# EAGLE design robocon line following sensor compact (EAGLE 7.2.0)
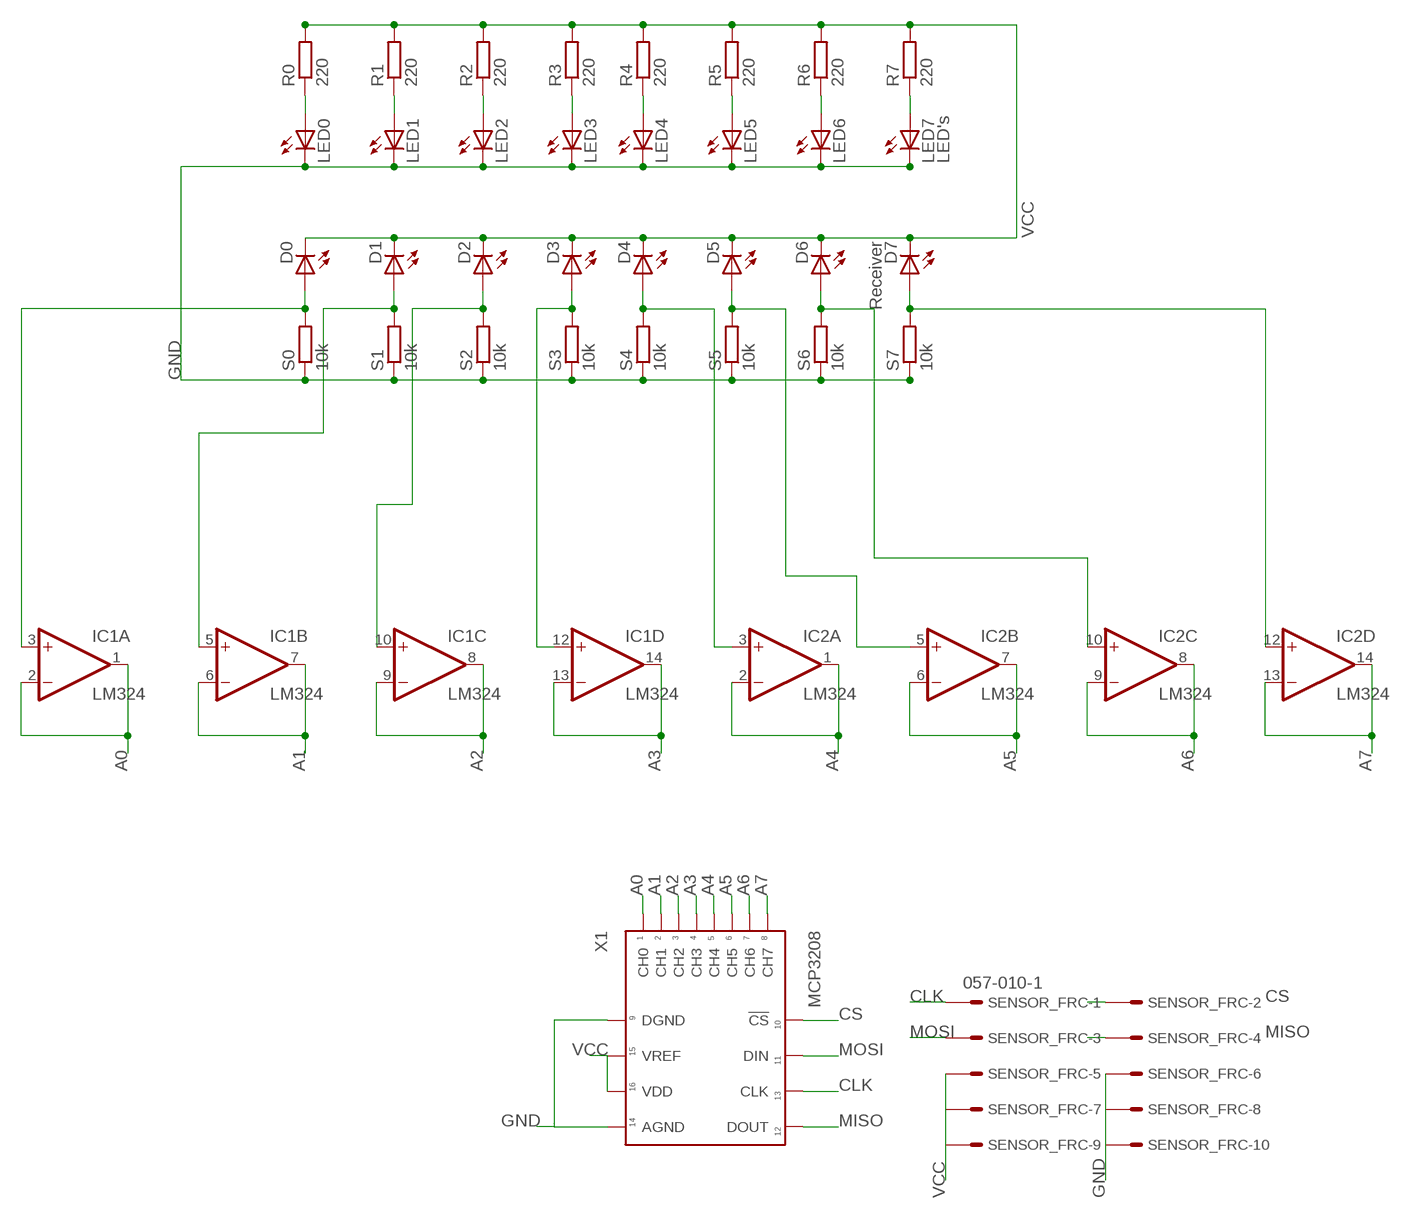
[diagram p0: schematic, sheet 1]

## Parts
D0  LED5MM  [LED5MM]
D1  LED5MM  [LED5MM]
D2  LED5MM  [LED5MM]
D3  LED5MM  [LED5MM]
D4  LED5MM  [LED5MM]
D5  LED5MM  [LED5MM]
D6  LED5MM  [LED5MM]
D7  Receiver  LED5MM  [LED5MM]
IC1  LM324  LM324N  [DIL14]
IC2  LM324  LM324N  [DIL14]
LED0  LED5MM  [LED5MM]
LED1  LED5MM  [LED5MM]
LED2  LED5MM  [LED5MM]
LED3  LED5MM  [LED5MM]
LED4  LED5MM  [LED5MM]
LED5  LED5MM  [LED5MM]
LED6  LED5MM  [LED5MM]
LED7  LED's  LED5MM  [LED5MM]
R0  220  R-EU_0207/10  [0207/10]
R1  220  R-EU_0207/10  [0207/10]
R2  220  R-EU_0207/10  [0207/10]
R3  220  R-EU_0207/10  [0207/10]
R4  220  R-EU_0207/10  [0207/10]
R5  220  R-EU_0207/10  [0207/10]
R6  220  R-EU_0207/10  [0207/10]
R7  220  R-EU_0207/10  [0207/10]
S0  10k  R-EU_0207/10  [0207/10]
S1  10k  R-EU_0207/10  [0207/10]
S2  10k  R-EU_0207/10  [0207/10]
S3  10k  R-EU_0207/10  [0207/10]
S4  10k  R-EU_0207/10  [0207/10]
S5  10k  R-EU_0207/10  [0207/10]
S6  10k  R-EU_0207/10  [0207/10]
S7  10k  R-EU_0207/10  [0207/10]
SENSOR_FRC  057-010-1  [057-010-1]
X1  MCP3208  21298EDIP  [DIP16]

## Nets
A0: IC1.1(A:OUT) IC1.2(A:-IN) X1.P$1(CH0)
A1: IC1.6(B:-IN) IC1.7(B:OUT) X1.P$2(CH1)
A2: IC1.8(C:OUT) IC1.9(C:-IN) X1.P$3(CH2)
A3: IC1.13(D:-IN) IC1.14(D:OUT) X1.P$4(CH3)
A4: IC2.1(A:OUT) IC2.2(A:-IN) X1.P$5(CH4)
A5: IC2.6(B:-IN) IC2.7(B:OUT) X1.P$6(CH5)
A6: IC2.8(C:OUT) IC2.9(C:-IN) X1.P$7(CH6)
A7: IC2.13(D:-IN) IC2.14(D:OUT) X1.P$8(CH7)
CLK: SENSOR_FRC.1 X1.P$13(CLK)
CS: SENSOR_FRC.2 X1.P$10(!CS)
GND: LED0.K(C) LED1.K(C) LED2.K(C) LED3.K(C) LED4.K(C) LED5.K(C) LED6.K(C) LED7.K(C) S0.1 S1.1 S2.1 S3.1 S4.1 S5.1 S6.1 S7.1 SENSOR_FRC.6 SENSOR_FRC.8 SENSOR_FRC.10 X1.P$9(DGND) X1.P$14(AGND)
MISO: SENSOR_FRC.4 X1.P$12(DOUT)
MOSI: SENSOR_FRC.3 X1.P$11(DIN)
N$1: LED0.A R0.1
N$2: LED1.A R1.1
N$3: LED2.A R2.1
N$4: LED3.A R3.1
N$5: LED4.A R4.1
N$6: LED5.A R5.1
N$7: LED6.A R6.1
N$8: LED7.A R7.1
N$11: D1.A IC1.5(B:+IN) S1.2
N$12: D2.A IC1.10(C:+IN) S2.2
N$13: D3.A IC1.12(D:+IN) S3.2
N$14: D4.A IC2.3(A:+IN) S4.2
N$15: D5.A IC2.5(B:+IN) S5.2
N$16: D6.A IC2.10(C:+IN) S6.2
N$18: D7.A IC2.12(D:+IN) S7.2
N$29: D0.A IC1.3(A:+IN) S0.2
VCC: D0.K(C) D1.K(C) D2.K(C) D3.K(C) D4.K(C) D5.K(C) D6.K(C) D7.K(C) R0.2 R1.2 R2.2 R3.2 R4.2 R5.2 R6.2 R7.2 SENSOR_FRC.5 SENSOR_FRC.7 SENSOR_FRC.9 X1.P$15(VREF) X1.P$16(VDD)

## Power pins joined to a net without a drawn wire
GND: IC1.11(P:V-) IC2.11(P:V-)
VCC: IC1.4(P:V+) IC2.4(P:V+)

## Library data of the parts
D0 D1-D7 LED0 LED1-LED7 = led:LED: LED OSRAM: - CHIPLED LG R971, LG N971, LY N971, LG Q971, LY Q971, LO R971, LY R971 LH N974, LH R974 LS Q976, LO Q976, LY Q976 LO Q996 - Hyper CHIPLED LW Q18S LB Q993, LB Q99A, LB R99A - SideLED LS A670, LO A670, LY A670, LG A670, LP A670 LB A673, LV A673, LT A673, LW A673 LH A674 LY A675 LS A676, LA A676, LO A676, LY A676, LW A676 LS A679, LY A679, LG A679 - Hyper Micro SIDELED® LS Y876, LA Y876, LO Y876, LY Y876 LT Y87S - SmartLED LW L88C, LW L88S LB L89C, LB L89S, LG L890 LS L89K, LO L89K, LY L89K LS L896, LA L896, LO L896, LY L896 - TOPLED LS T670, LO T670, LY T670, LG T670, LP T670 LSG T670, LSP T670, LSY T670, LOP T670, LYG T670 LG T671, LOG T671, LSG T671 LB T673, LV T673, LT T673, LW T673 LH T674 LS T676, LA T676, LO T676, LY T676, LB T676, LH T676, LSB T676, LW T676 LB T67C, LV T67C, LT T67C, LS T67K, LO T67K, LY T67K, LW E67C LS E67B, LA E67B, LO E67B, LY E67B, LB E67C, LV E67C, LT E67C LW T67C LS T679, LY T679, LG T679 LS T770, LO T770, LY T770, LG T770, LP T770 LB T773, LV T773, LT T773, LW T773 LH T774 LS E675, LA E675, LY E675, LS T675 LS T776, LA T776, LO T776, LY T776, LB T776 LHGB T686 LT T68C, LB T68C - Hyper Mini TOPLED® LB M676 - Mini TOPLED Santana® LG M470 LS M47K, LO M47K, LY M47K Source: http://www.osram.convergy.de LUXEON: - LUMILED® LXK2-PW12-R00, LXK2-PW12-S00, LXK2-PW14-U00, LXK2-PW14-V00 LXK2-PM12-R00, LXK2-PM12-S00, LXK2-PM14-U00 LXK2-PE12-Q00, LXK2-PE12-R00, LXK2-PE12-S00, LXK2-PE14-T00, LXK2-PE14-U00 LXK2-PB12-K00, LXK2-PB12-L00, LXK2-PB12-M00, LXK2-PB14-N00, LXK2-PB14-P00, LXK2-PB14-Q00 LXK2-PR12-L00, LXK2-PR12-M00, LXK2-PR14-Q00, LXK2-PR14-R00 LXK2-PD12-Q00, LXK2-PD12-R00, LXK2-PD12-S00 LXK2-PH12-R00, LXK2-PH12-S00 LXK2-PL12-P00, LXK2-PL12-Q00, LXK2-PL12-R00 Source: www.luxeon.com KINGBRIGHT: KA-3528ASYC Source: www.kingbright.com
IC1 IC2 = linear:LM324: OP AMP
R0 R1-R7 S0 S1-S7 = rcl:R-EU_: RESISTOR, European symbol
SENSOR_FRC = con-panduit:057-010-: CONNECTOR 10-pin series 057 contact pc board low profile headers; OC_FARNELL: unknown; OC_NEWARK: unknown
X1 = Microchip:21298E

## Board
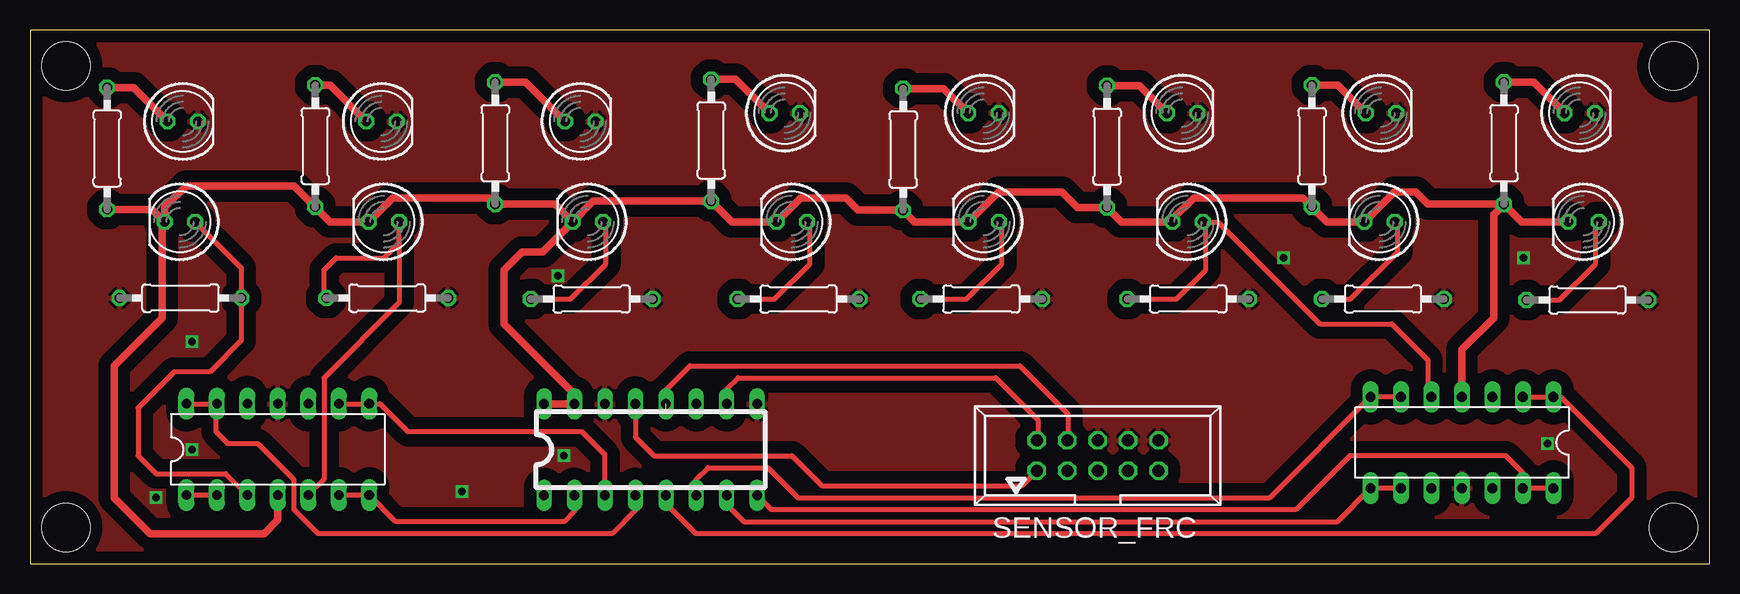
[diagram p1: board, top side]
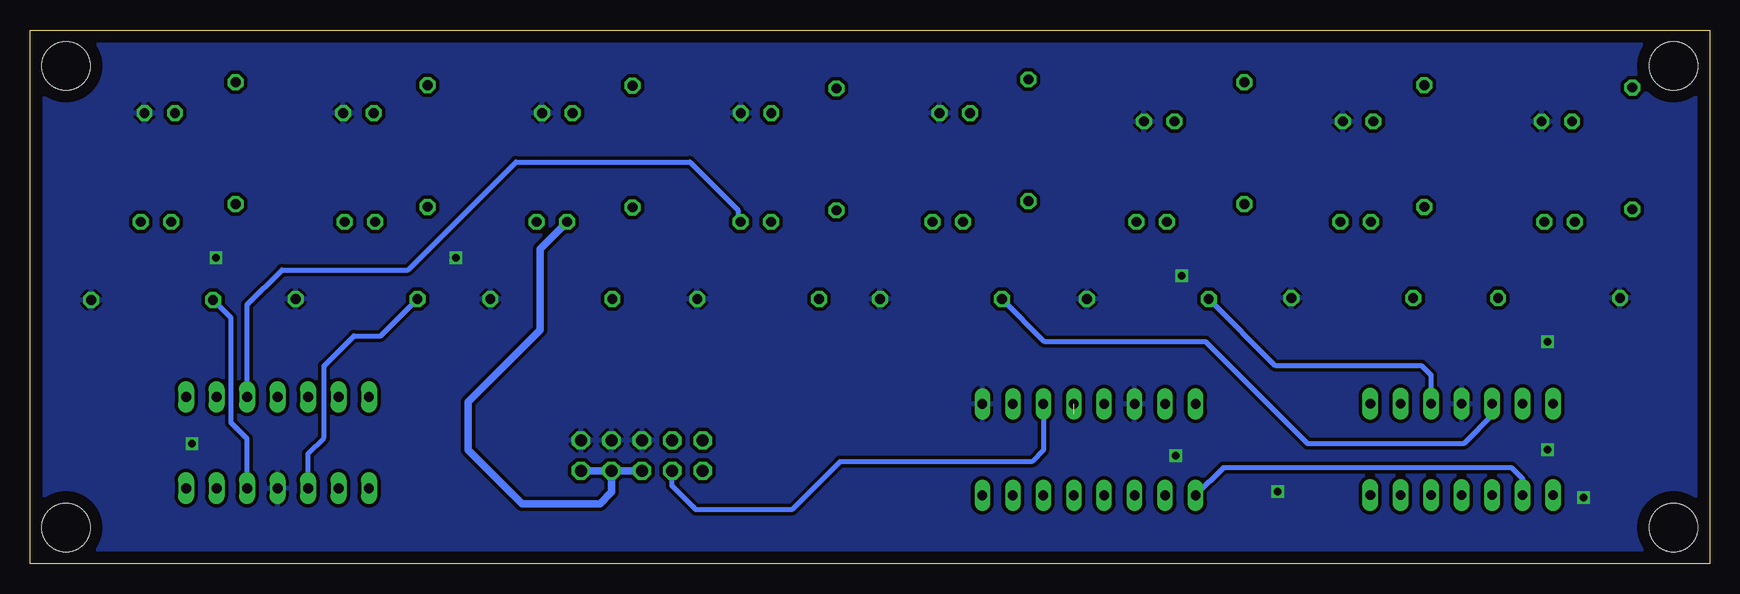
[diagram p2: board, bottom side, seen from below]

Size 140 x 44.5 mm. Coordinates in mm from the lower left corner, seen from the top.
Outline: 0,0 140,0 140,44.5 0,44.5 0,0
Copper layers (1*16): Top 0.035mm / dielectric 1.5mm / Bottom 0.035mm
Design rules "default *": minimum track width 10mil, minimum drill 24mil, track to track 10mil, track to pad 10mil, pad to pad 10mil, via to via 10mil, smd to smd 8mil, copper to edge 40mil, drill to drill 8mil, minimum pad ring 10mil, minimum via ring 8mil, stop-mask expansion 4mil, vias tented up to drill 0mil, thermal gap 10mil
Holes 4 mm at 3,41.5 137,41.5 137,3 3,3

### Footprints (pad centres in the part's own frame; a part is rotated, then mirrored left to right if it is on the bottom)
LED5MM = drill 0.813 octagon: A -1.27,0; K 1.27,0
DIL14 = drill 0.813 long: 1 -7.62,-3.81; 2 -5.08,-3.81; 3 -2.54,-3.81; 4 0,-3.81; 5 2.54,-3.81; 6 5.08,-3.81; 7 7.62,-3.81; 8 7.62,3.81; 9 5.08,3.81; 10 2.54,3.81; 11 0,3.81; 12 -2.54,3.81; 13 -5.08,3.81; 14 -7.62,3.81
0207/10 = drill 0.813 octagon: 1 -5.08,0; 2 5.08,0
057-010-1 = drill 1 octagon: 1 -5.08,-1.27; 2 -5.08,1.27; 3 -2.54,-1.27; 4 -2.54,1.27; 5 0,-1.27; 6 0,1.27; 7 2.54,-1.27; 8 2.54,1.27; 9 5.08,-1.27; 10 5.08,1.27
DIP16 = drill 0.8 long: P$1 -10.16,-3.81; P$2 -7.62,-3.81; P$3 -5.08,-3.81; P$4 -2.54,-3.81; P$5 0,-3.81; P$6 2.54,-3.81; P$7 5.08,-3.81; P$8 7.62,-3.81; P$9 7.62,3.81; P$10 5.08,3.81; P$11 2.54,3.81; P$12 0,3.81; P$13 -2.54,3.81; P$14 -5.08,3.81; P$15 -7.62,3.81; P$16 -10.16,3.81

### Placement (x,y rotation side)
D0  12.5,28.5 180 top
D1  29.5,28.5 180 top
D2  46.5,28.5 180 top
D3  63.5,28.5 180 top
D4  79.5,28.5 180 top
D5  96.5,28.5 180 top
D6  112.5,28.5 180 top
D7  129.5,28.5 180 top
IC1  20.66,9.52 0 top
IC2  119.36,10.09 180 top
LED0  12.73,36.87 0 top
LED1  29.3,36.87 0 top
LED2  45.87,36.87 0 top
LED3  62.91,37.57 0 top
LED4  79.48,37.57 0 top
LED5  96.05,37.57 0 top
LED6  112.62,37.57 0 top
LED7  129.19,37.57 0 top
R0  6.43,34.62 270 top
R1  23.78,34.82 270 top
R2  38.78,35.06 270 top
R3  56.78,35.3 270 top
R4  72.78,34.54 270 top
R5  89.78,34.78 270 top
R6  106.86,34.82 270 top
R7  122.86,35.06 270 top
S0  12.54,22.14 0 top
S1  29.78,22.14 180 top
S2  46.82,22.06 180 top
S3  64.06,22.06 180 top
S4  79.3,22.06 180 top
S5  96.54,22.06 180 top
S6  112.78,22.06 180 top
S7  129.82,21.98 180 top
SENSOR_FRC  89,9 0 top
X1  53,9.5 0 top

### Tracks (layer width: path | path; a pad name or v marks a point on that pad's centre or on a via)
A0
  Top 0.406: IC1.1 IC1.2
  Bottom 0.406: IC1.2 15.58,7.08 16.5,8 40.53,8 X1.P$1
A1
  Top 0.406: IC1.6 IC1.7 30.49,3.5 44.5,3.5 45.38,4.38 X1.P$2
A2
  Top 0.406: IC1.9 IC1.8 29.17,13.33 31.5,11 46,11 47.92,9.08 X1.P$3
A3
  Top 0.406: IC1.14 IC1.13 15.5,13.25 15.5,11 16.5,10 19,10 22,7 22,4.5 24,2.5 48.5,2.5 50.46,4.46 X1.P$4
A4
  Top 0.406: IC2.1 IC2.2 127.6,13.9 133.5,8 133.5,5.5 130.5,2.5 55.5,2.5 53,5 X1.P$5
A5
  Top 0.406: IC2.6 IC2.7 103.34,5.5 64,5.5 61.5,8 56.5,8 55.54,7.04 X1.P$6
A6
  Top 0.406: IC2.9 IC2.8 108.96,3.5 59.5,3.5 58.08,4.92 X1.P$7
A7
  Top 0.406: IC2.14 IC2.13 124.44,7.56 123,9 110,9 105.5,4.5 61.81,4.5 X1.P$8
CLK
  Top 0.406: X1.P$13 50.46,10.54 52,9 63.5,9 66,6.5 82.69,6.5 SENSOR_FRC.1
CS
  Top 0.406: X1.P$10 58.08,14.58 59,15.5 80.5,15.5 84,12 84,10.35 SENSOR_FRC.2
GND  (via drill 0.6)
  other vias: 104.5,25.5 13.5,18.5 36,6 13.5,9.5 10.5,5.5 44,24 44.5,9 126.5,10 124.5,25.5
  pour Bottom (isolate 0.305): 0,44.5 140,44.5 140,0 0,0
  pour Top (isolate 1.016): 0,44.5 0,0 140,0 140,44.5
MISO  (1 unrouted)
  Top 0.406: 53,12.5 53,14.5 55,16.5 82.5,16.5 86.5,12.5 86.5,10.31 SENSOR_FRC.4
MOSI
  Bottom 0.406: X1.P$11 55.54,9.46 56.5,8.5 72.5,8.5 76.5,4.5 84.5,4.5 86.5,6.5 86.5,7.69 SENSOR_FRC.3
N$1
  Top 0.61: R0.1 8.63,39.7 LED0.A
N$2
  Top 0.61: R1.1 25,39.9 LED1.A
N$3
  Top 0.61: R2.1 41.33,40.14 LED2.A
N$4
  Top 0.61: R3.1 58.83,40.38 LED3.A
N$5
  Top 0.61: R4.1 76.16,39.62 LED4.A
N$6
  Top 0.61: R5.1 92.49,39.86 LED5.A
N$7
  Top 0.61: R6.1 109.02,39.9 LED6.A
N$8
  Top 0.61: R7.1 125.35,40.14 LED7.A
N$11
  Top 0.406: S1.2 24.5,22.34 24.5,24.5 25.5,25.5 29.5,25.5 30.77,26.77 | 30.77,26.77 D1.A | 30.77,26.77 30.77,21.77 24.5,15.5 24.5,7.01 IC1.5
N$12
  Top 0.406: S2.2 45.06,22.06 48,25 48,28.27 D2.A
  Bottom 0.406: IC1.10 23.2,15.7 24,16.5 36.18,16.5 S2.2
N$13
  Top 0.406: S3.2 62.06,22.06 65,25 65,28.27 D3.A
  Bottom 0.406: IC1.12 18.12,12.38 20.5,10 33.5,10 42,18.5 55.42,18.5 S3.2
N$14
  Top 0.406: S4.2 78.06,22.06 81,25 81,28.27 D4.A
  Bottom 0.406: IC2.3 121.9,21.6 119,24.5 108.5,24.5 99.5,33.5 85,33.5 81,29.5 81,28.73 D4.A
N$15
  Top 0.406: S5.2 95.56,22.06 98,24.5 98,28.27 D5.A 99,28.5 107.5,20 113.5,20 116.5,17 116.5,14.22 IC2.5
N$16
  Top 0.406: S6.2 110.06,22.06 114,26 114,28.27 D6.A
  Bottom 0.406: IC2.10 116.82,9.18 115.5,10.5 115.5,16.5 113,19 110.76,19 S6.2
N$18
  Top 0.406: S7.2 127.48,21.98 130.5,25 130.5,28.23 D7.A
  Bottom 0.406: IC2.12 121.9,10.4 123.25,11.75 123.25,20.49 S7.2
N$29
  Top 0.406: D0.A 17.62,24.65 S0.2 17.62,18.62 15,16 12,16 9,13 9,9 10.5,7.5 16.33,7.5 IC1.3
VCC
  Top 0.61: R0.2 10.19,29.54 D0.K | D0.K 11.23,29.73 13,31.5 22.02,31.5 R1.2 25.02,28.5 D1.K 30.23,30.5 38.26,30.5 R2.2 43.75,29.98 D2.K | D2.K 46.95,30.22 R3.2 58.5,28.5 D3.K 64.23,30.5 68,30.5 69.04,29.46 R4.2 73.74,28.5 D4.K 80.73,31 86,31 87.3,29.7 R5.2 90.98,28.5 D5.K 95.23,28.73 97,30.5 106.1,30.5 R6.2 108.1,28.5 D6.K 113.73,31 115.5,31 116.52,29.98 R7.2 | R7.2 124.34,28.5 D7.K | IC2.4 119.36,17.86 122,20.5 122,29.12 R7.2 | IC1.4 20.66,3.66 19.5,2.5 10,2.5 7,5.5 7,16.5 11,20.5 11,28.27 D0.K | X1.P$16 X1.P$15 45.38,14.12 39.5,20 39.5,24.5 41,26 42.73,26 D2.K
  Bottom 0.61: SENSOR_FRC.5 SENSOR_FRC.7 | SENSOR_FRC.7 SENSOR_FRC.9 | SENSOR_FRC.7 91.54,5.96 92.5,5 99,5 103.5,9.5 103.5,13.5 97.5,19.5 97.5,26.23 D5.K

### Text on the board
tValues: Society of Robotics and Automation | ROBOCON 2017